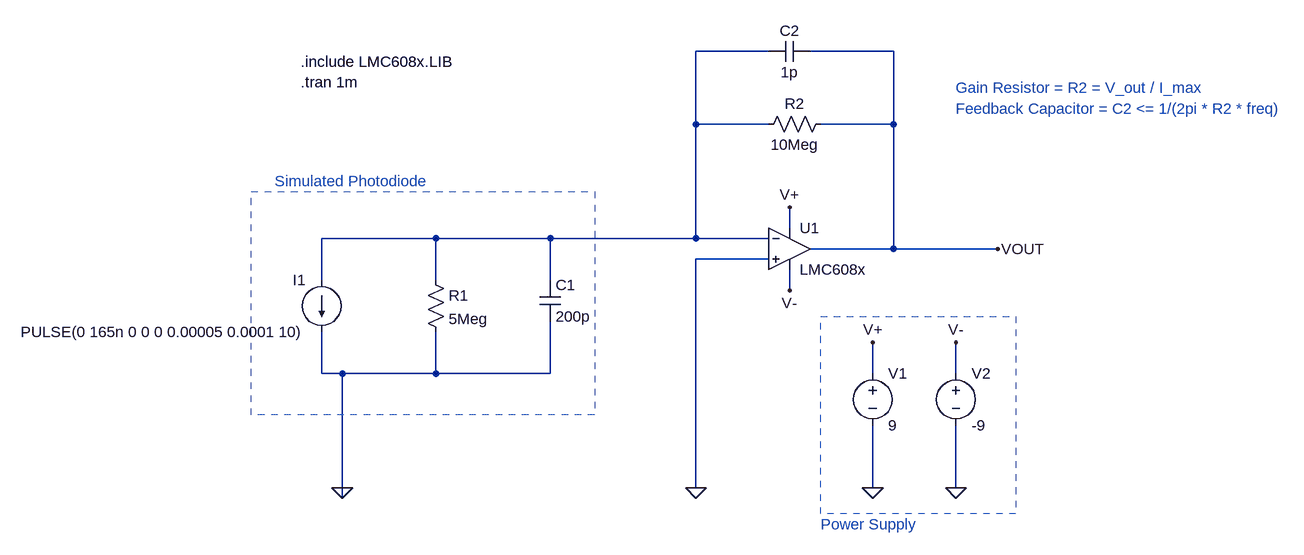
[diagram p0: schematic schematic.asc]
schematic.asc, the LTspice schematic file:
Version 4
SHEET 1 1620 696
WIRE 816 -48 704 -48
WIRE 1008 -48 880 -48
WIRE 704 64 704 -48
WIRE 816 64 704 64
WIRE 1008 64 1008 -48
WIRE 1008 64 896 64
WIRE 848 224 848 192
WIRE 304 240 128 240
WIRE 480 240 304 240
WIRE 704 240 704 64
WIRE 704 240 480 240
WIRE 816 240 704 240
WIRE 1008 256 1008 64
WIRE 1008 256 880 256
WIRE 1168 256 1008 256
WIRE 816 272 704 272
WIRE 128 304 128 240
WIRE 304 304 304 240
WIRE 480 304 480 240
WIRE 848 320 848 288
WIRE 128 448 128 384
WIRE 160 448 128 448
WIRE 304 448 304 384
WIRE 304 448 160 448
WIRE 480 448 480 368
WIRE 480 448 304 448
WIRE 976 448 976 400
WIRE 1104 448 1104 400
WIRE 160 624 160 448
WIRE 704 624 704 272
WIRE 976 624 976 528
WIRE 1104 624 1104 528
WIRE 160 640 160 624
FLAG 160 624 0
FLAG 1168 256 VOUT
FLAG 976 624 0
FLAG 1104 624 0
FLAG 976 400 V+
FLAG 1104 400 V-
FLAG 848 192 V+
FLAG 848 320 V-
FLAG 704 624 0
SYMBOL current 128 304 M0
SYMATTR InstName I1
SYMATTR Value PULSE(0 165n 0 0 0 0.00005 0.0001 10)
SYMBOL Res 288 288 R0
SYMATTR InstName R1
SYMATTR Value 5Meg
SYMBOL Cap 464 304 R0
SYMATTR InstName C1
SYMATTR Value 200p
SYMBOL OpAmps/opamp2 848 192 R0
SYMATTR InstName U1
SYMATTR Value LMC608x
SYMBOL Res 912 48 R90
WINDOW 0 0 56 VBottom 2
WINDOW 3 32 56 VTop 2
SYMATTR InstName R2
SYMATTR Value 10Meg
SYMBOL Cap 880 -64 R90
WINDOW 0 0 32 VBottom 2
WINDOW 3 32 32 VTop 2
SYMATTR InstName C2
SYMATTR Value 1p
SYMBOL voltage 976 432 R0
SYMATTR InstName V1
SYMATTR Value 9
SYMBOL voltage 1104 432 R0
SYMATTR InstName V2
SYMATTR Value -9
TEXT 56 152 Left 2 ;Simulated Photodiode
TEXT 896 680 Left 2 ;Power Supply
TEXT 96 -32 Left 2 !.include LMC608x.LIB\n.tran 1m
TEXT 1104 8 Left 2 ;Gain Resistor = R2 = V_out / I_max
TEXT 1104 40 Left 2 ;Feedback Capacitor = C2 <= 1/(2pi * R2 * freq)
RECTANGLE Normal 20 168 548 512 3
RECTANGLE Normal 896 360 1196 664 3

The netlist it stands for:
* schematic.asc
I1 N001 0 PULSE(0 165n 0 0 0 0.00005 0.0001 10)
R1 N001 0 5Meg
C1 N001 0 200p
XU1 0 N001 V+ V- VOUT LMC608x  ; pins In+ In- V+ V- OUT
R2 VOUT N001 10Meg
C2 VOUT N001 1p
V1 V+ 0 9
V2 V- 0 -9
* Simulated Photodiode
* Power Supply
.include LMC608x.LIB
.tran 1m
* Gain Resistor = R2 = V_out / I_max
* Feedback Capacitor = C2 <= 1/(2pi * R2 * freq)
.backanno
.end